# EAGLE schematic stage3 (EAGLE 9.4.0)
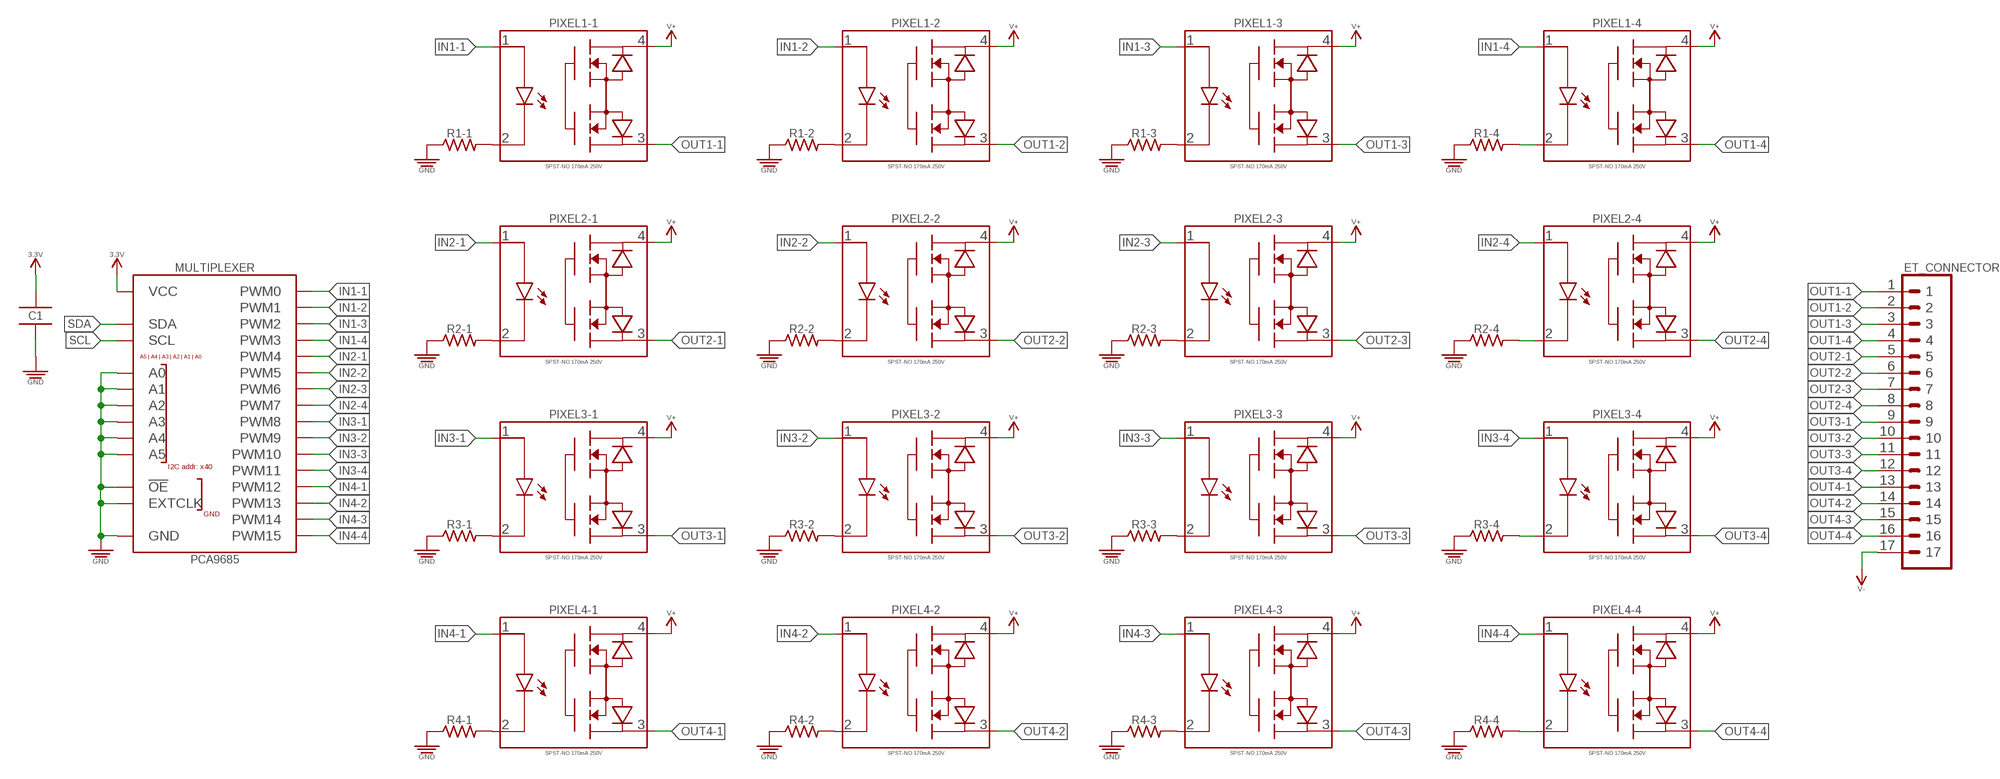
[diagram p0: schematic, sheet 1]

## Parts
C1  0.1uF/50V  0.1UF_SMD-0402_50V-10%  [CAPC1005X55_SMD-0402]
ET_CONNECTOR  1x17 MOLEX SMD RA  1X17_SMD_MOLEX  [1X17_MOLEX_0532611771_RA_SMD]
MULTIPLEXER  PCA9685  PCA9685_16-CH_12-BIT_PWM-DRIVER_TSSOP-28_PWM-DRIVER_16CH  [SOP65P650X110-28]
PIXEL1-1  SPST-NO 170mA 250V  RELAY_SOLID-STATE_SSR_170MA_250V_SPST-NO  [SOP254P609X203-4]
PIXEL1-2  SPST-NO 170mA 250V  RELAY_SOLID-STATE_SSR_170MA_250V_SPST-NO  [SOP254P609X203-4]
PIXEL1-3  SPST-NO 170mA 250V  RELAY_SOLID-STATE_SSR_170MA_250V_SPST-NO  [SOP254P609X203-4]
PIXEL1-4  SPST-NO 170mA 250V  RELAY_SOLID-STATE_SSR_170MA_250V_SPST-NO  [SOP254P609X203-4]
PIXEL2-1  SPST-NO 170mA 250V  RELAY_SOLID-STATE_SSR_170MA_250V_SPST-NO  [SOP254P609X203-4]
PIXEL2-2  SPST-NO 170mA 250V  RELAY_SOLID-STATE_SSR_170MA_250V_SPST-NO  [SOP254P609X203-4]
PIXEL2-3  SPST-NO 170mA 250V  RELAY_SOLID-STATE_SSR_170MA_250V_SPST-NO  [SOP254P609X203-4]
PIXEL2-4  SPST-NO 170mA 250V  RELAY_SOLID-STATE_SSR_170MA_250V_SPST-NO  [SOP254P609X203-4]
PIXEL3-1  SPST-NO 170mA 250V  RELAY_SOLID-STATE_SSR_170MA_250V_SPST-NO  [SOP254P609X203-4]
PIXEL3-2  SPST-NO 170mA 250V  RELAY_SOLID-STATE_SSR_170MA_250V_SPST-NO  [SOP254P609X203-4]
PIXEL3-3  SPST-NO 170mA 250V  RELAY_SOLID-STATE_SSR_170MA_250V_SPST-NO  [SOP254P609X203-4]
PIXEL3-4  SPST-NO 170mA 250V  RELAY_SOLID-STATE_SSR_170MA_250V_SPST-NO  [SOP254P609X203-4]
PIXEL4-1  SPST-NO 170mA 250V  RELAY_SOLID-STATE_SSR_170MA_250V_SPST-NO  [SOP254P609X203-4]
PIXEL4-2  SPST-NO 170mA 250V  RELAY_SOLID-STATE_SSR_170MA_250V_SPST-NO  [SOP254P609X203-4]
PIXEL4-3  SPST-NO 170mA 250V  RELAY_SOLID-STATE_SSR_170MA_250V_SPST-NO  [SOP254P609X203-4]
PIXEL4-4  SPST-NO 170mA 250V  RELAY_SOLID-STATE_SSR_170MA_250V_SPST-NO  [SOP254P609X203-4]
R1-1  1K  1KΩ_SMD-0402_1/16W-5%  [RESC1005X35_SMD-0402]
R1-2  1K  1KΩ_SMD-0402_1/16W-5%  [RESC1005X35_SMD-0402]
R1-3  1K  1KΩ_SMD-0402_1/16W-5%  [RESC1005X35_SMD-0402]
R1-4  1K  1KΩ_SMD-0402_1/16W-5%  [RESC1005X35_SMD-0402]
R2-1  1K  1KΩ_SMD-0402_1/16W-5%  [RESC1005X35_SMD-0402]
R2-2  1K  1KΩ_SMD-0402_1/16W-5%  [RESC1005X35_SMD-0402]
R2-3  1K  1KΩ_SMD-0402_1/16W-5%  [RESC1005X35_SMD-0402]
R2-4  1K  1KΩ_SMD-0402_1/16W-5%  [RESC1005X35_SMD-0402]
R3-1  1K  1KΩ_SMD-0402_1/16W-5%  [RESC1005X35_SMD-0402]
R3-2  1K  1KΩ_SMD-0402_1/16W-5%  [RESC1005X35_SMD-0402]
R3-3  1K  1KΩ_SMD-0402_1/16W-5%  [RESC1005X35_SMD-0402]
R3-4  1K  1KΩ_SMD-0402_1/16W-5%  [RESC1005X35_SMD-0402]
R4-1  1K  1KΩ_SMD-0402_1/16W-5%  [RESC1005X35_SMD-0402]
R4-2  1K  1KΩ_SMD-0402_1/16W-5%  [RESC1005X35_SMD-0402]
R4-3  1K  1KΩ_SMD-0402_1/16W-5%  [RESC1005X35_SMD-0402]
R4-4  1K  1KΩ_SMD-0402_1/16W-5%  [RESC1005X35_SMD-0402]

## Nets
3.3V: C1.1 MULTIPLEXER.28(VCC)
GND [DGND]: C1.2 MULTIPLEXER.1(A0) MULTIPLEXER.2(A1) MULTIPLEXER.3(A2) MULTIPLEXER.4(A3) MULTIPLEXER.5(A4) MULTIPLEXER.14(GND) MULTIPLEXER.23(!OE) MULTIPLEXER.24(A5) MULTIPLEXER.25(EXTCLK) R1-1.1 R1-2.1 R1-3.1 R1-4.1 R2-1.1 R2-2.1 R2-3.1 R2-4.1 R3-1.1 R3-2.1 R3-3.1 R3-4.1 R4-1.1 R4-2.1 R4-3.1 R4-4.1
IN1-1: MULTIPLEXER.6(PWM0) PIXEL1-1.1
IN1-2: MULTIPLEXER.7(PWM1) PIXEL1-2.1
IN1-3: MULTIPLEXER.8(PWM2) PIXEL1-3.1
IN1-4: MULTIPLEXER.9(PWM3) PIXEL1-4.1
IN2-1: MULTIPLEXER.10(PWM4) PIXEL2-1.1
IN2-2: MULTIPLEXER.11(PWM5) PIXEL2-2.1
IN2-3: MULTIPLEXER.12(PWM6) PIXEL2-3.1
IN2-4: MULTIPLEXER.13(PWM7) PIXEL2-4.1
IN3-1: MULTIPLEXER.15(PWM8) PIXEL3-1.1
IN3-2: MULTIPLEXER.16(PWM9) PIXEL3-2.1
IN3-3: MULTIPLEXER.17(PWM10) PIXEL3-3.1
IN3-4: MULTIPLEXER.18(PWM11) PIXEL3-4.1
IN4-1: MULTIPLEXER.19(PWM12) PIXEL4-1.1
IN4-2: MULTIPLEXER.20(PWM13) PIXEL4-2.1
IN4-3: MULTIPLEXER.21(PWM14) PIXEL4-3.1
IN4-4: MULTIPLEXER.22(PWM15) PIXEL4-4.1
N$33: PIXEL1-3.2 R1-3.2
N$39: PIXEL1-1.2 R1-1.2
N$57: PIXEL1-2.2 R1-2.2
N$59: PIXEL1-4.2 R1-4.2
N$60: PIXEL2-1.2 R2-1.2
N$61: PIXEL2-2.2 R2-2.2
N$64: PIXEL2-3.2 R2-3.2
N$65: PIXEL2-4.2 R2-4.2
N$66: PIXEL3-1.2 R3-1.2
N$67: PIXEL3-2.2 R3-2.2
N$68: PIXEL3-3.2 R3-3.2
N$69: PIXEL3-4.2 R3-4.2
N$70: PIXEL4-1.2 R4-1.2
N$71: PIXEL4-2.2 R4-2.2
N$72: PIXEL4-3.2 R4-3.2
N$73: PIXEL4-4.2 R4-4.2
OUT1-1 [DGND]: ET_CONNECTOR.1 PIXEL1-1.3
OUT1-2 [DGND]: ET_CONNECTOR.2 PIXEL1-2.3
OUT1-3 [DGND]: ET_CONNECTOR.3 PIXEL1-3.3
OUT1-4 [DGND]: ET_CONNECTOR.4 PIXEL1-4.3
OUT2-1 [DGND]: ET_CONNECTOR.5 PIXEL2-1.3
OUT2-2 [DGND]: ET_CONNECTOR.6 PIXEL2-2.3
OUT2-3 [DGND]: ET_CONNECTOR.7 PIXEL2-3.3
OUT2-4 [DGND]: ET_CONNECTOR.8 PIXEL2-4.3
OUT3-1 [DGND]: ET_CONNECTOR.9 PIXEL3-1.3
OUT3-2 [DGND]: ET_CONNECTOR.10 PIXEL3-2.3
OUT3-3 [DGND]: ET_CONNECTOR.11 PIXEL3-3.3
OUT3-4 [DGND]: ET_CONNECTOR.12 PIXEL3-4.3
OUT4-1 [DGND]: ET_CONNECTOR.13 PIXEL4-1.3
OUT4-2 [DGND]: ET_CONNECTOR.14 PIXEL4-2.3
OUT4-3 [DGND]: ET_CONNECTOR.15 PIXEL4-3.3
OUT4-4 [DGND]: ET_CONNECTOR.16 PIXEL4-4.3
SCL: MULTIPLEXER.26(SCL)
SDA: MULTIPLEXER.27(SDA)
V+: PIXEL1-1.4 PIXEL1-2.4 PIXEL1-3.4 PIXEL1-4.4 PIXEL2-1.4 PIXEL2-2.4 PIXEL2-3.4 PIXEL2-4.4 PIXEL3-1.4 PIXEL3-2.4 PIXEL3-3.4 PIXEL3-4.4 PIXEL4-1.4 PIXEL4-2.4 PIXEL4-3.4 PIXEL4-4.4
V- [DGND]: ET_CONNECTOR.17

## Library data of the parts
C1 = _capacitors:0.1UF; DATASHEET: https://product.tdk.com/info/en/catalog/datasheets/mlcc_commercial_soft_en.pdf; DIST: Digikey; DISTLINK: https://www.digikey.com/products/en?keywords=445-173610-1-ND; DISTPN: 445-173610-1-ND; MFR: TDK Corporation; MPN: C1005X7R1H104K050BE
ET_CONNECTOR = _connectors:1X17; DATASHEET: https://www.molex.com/pdm_docs/sd/532611771_sd.pdf; DATASHEET_CRIMP: https://www.molex.com/pdm_docs/sd/500798000_sd.pdf; DATASHEET_HOUSING: https://www.mouser.com/datasheet/2/276/0510211700_CRIMP_HOUSINGS-701987.pdf; DIST: Digikey; DISTLINK: https://www.digikey.com/products/en?keywords=WM10108CT-ND; DISTLINK_CRIMP: https://www.digikey.com/products/en?keywords=WM1142CT-ND; DISTLINK_HOUSING: https://www.mouser.com/ProductDetail/Molex/51021-1700?qs=%2Fha2pyFaduhTtHxds%252BiZNyfft3LkIIpppXLQlmBH7R4%3D; DISTPN: WM10108CT-ND; DISTPN_CRIMP: WM1142CT-ND; DISTPN_HOUSING: 538-51021-1700; DIST_CRIMP: Digikey; DIST_HOUSING: Mouser; MFR: Molex; MFR_CRIMP: Molex; MFR_HOUSING: Molex; MPN: 0532611771; MPN_CRIMP: 0500798000; MPN_HOUSING: 51021-1700
MULTIPLEXER = _special:PCA9685_16-CH_12-BIT_PWM-DRIVER; DATASHEET: https://www.nxp.com/docs/en/data-sheet/PCA9685.pdf; DIST: Digikey; DISTLINK: https://www.digikey.com/products/en?keywords=568-11925-1-ND; DISTPN: 568-11925-1-ND; MFR: NXP USA Inc.; MPN: PCA9685PW,118
PIXEL1-1-PIXEL1-4 PIXEL2-1-PIXEL2-4 PIXEL3-1-PIXEL3-4 PIXEL4-1-PIXEL4-4 = _relay:RELAY_SOLID-STATE; DATASHEET: http://www.ixysic.com/home/pdfs.nsf/www/CPC1010N.pdf/$file/CPC1010N.pdf; DIST: Digikey; DISTLINK: https://www.digikey.com/products/en?keywords=CPC1010N-ND; DISTPN: CPC1010N-ND; MFR: IXYS Integrated Circuits Division; MPN: CPC1010N
R1-1-R1-4 R2-1-R2-4 R3-1-R3-4 R4-1-R4-4 = _resistors:1KΩ; DATASHEET: http://www.yageo.com/documents/recent/PYu-RC_Group_51_RoHS_L_9.pdf; DIST: Digikey; DISTLINK: https://www.digikey.com/products/en?keywords=311-1.0KJRCT-ND; DISTPN: 311-1.0KJRCT-ND; MFR: Yageo; MPN: RC0402JR-071KL

## Net classes
4 DGND: width 0.152 mm